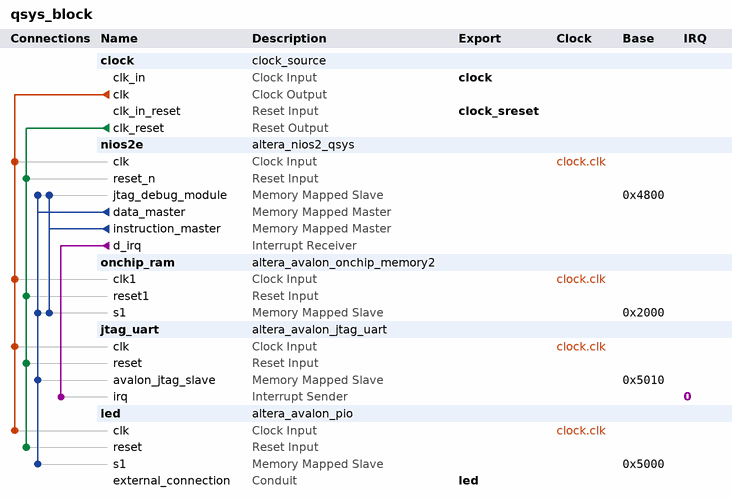
[diagram p0: system contents]
# Platform Designer (Qsys) system qsys_block, Cyclone IV E EP4CE22F17C6
# Parameters at their usual value, and those the tool derives, are not listed.
package require -exact qsys 13.1
create_system qsys_block
set_project_property DEVICE_FAMILY {Cyclone IV E}
set_project_property DEVICE EP4CE22F17C6

add_instance clock clock_source 13.1
set_instance_parameter_value clock clockFrequency 50000000
set_instance_parameter_value clock resetSynchronousEdges BOTH

add_instance nios2e altera_nios2_qsys 13.1
set_instance_parameter_value nios2e resetSlave onchip_ram.s1
set_instance_parameter_value nios2e mmu_TLBMissExcSlave None
set_instance_parameter_value nios2e exceptionSlave onchip_ram.s1
set_instance_parameter_value nios2e breakSlave nios2e.jtag_debug_module
set_instance_parameter_value nios2e impl Tiny
set_instance_parameter_value nios2e icache_size 4096

add_instance onchip_ram altera_avalon_onchip_memory2 13.1
set_instance_parameter_value onchip_ram dataWidth 32
set_instance_parameter_value onchip_ram dualPort false
set_instance_parameter_value onchip_ram initMemContent true
set_instance_parameter_value onchip_ram initializationFileName onchip_mem.hex
set_instance_parameter_value onchip_ram memorySize 8192

add_instance jtag_uart altera_avalon_jtag_uart 13.1
set_instance_parameter_value jtag_uart simInteractiveOptions NO_INTERACTIVE_WINDOWS

add_instance led altera_avalon_pio 13.1
set_instance_parameter_value led direction Output
set_instance_parameter_value led width 8

# connections
add_connection clock.clk jtag_uart.clk clock
add_connection clock.clk led.clk clock
add_connection clock.clk nios2e.clk clock
add_connection clock.clk onchip_ram.clk1 clock
add_connection clock.clk_reset jtag_uart.reset reset
add_connection clock.clk_reset led.reset reset
add_connection clock.clk_reset nios2e.reset_n reset
add_connection clock.clk_reset onchip_ram.reset1 reset
add_connection nios2e.data_master jtag_uart.avalon_jtag_slave avalon
set_connection_parameter_value nios2e.data_master/jtag_uart.avalon_jtag_slave baseAddress 0x5010
add_connection nios2e.data_master led.s1 avalon
set_connection_parameter_value nios2e.data_master/led.s1 baseAddress 0x5000
add_connection nios2e.data_master nios2e.jtag_debug_module avalon
set_connection_parameter_value nios2e.data_master/nios2e.jtag_debug_module baseAddress 0x4800
add_connection nios2e.data_master onchip_ram.s1 avalon
set_connection_parameter_value nios2e.data_master/onchip_ram.s1 baseAddress 0x2000
add_connection nios2e.instruction_master nios2e.jtag_debug_module avalon
set_connection_parameter_value nios2e.instruction_master/nios2e.jtag_debug_module baseAddress 0x4800
add_connection nios2e.instruction_master onchip_ram.s1 avalon
set_connection_parameter_value nios2e.instruction_master/onchip_ram.s1 baseAddress 0x2000
add_connection nios2e.d_irq jtag_uart.irq interrupt
set_connection_parameter_value nios2e.d_irq/jtag_uart.irq irqNumber 0

# exported interfaces
add_interface clock clock sink
set_interface_property clock EXPORT_OF clock.clk_in
add_interface clock_sreset reset sink
set_interface_property clock_sreset EXPORT_OF clock.clk_in_reset
add_interface led conduit end
set_interface_property led EXPORT_OF led.external_connection

set_interconnect_requirement {$system} qsys_mm.clockCrossingAdapter HANDSHAKE
set_interconnect_requirement {$system} qsys_mm.maxAdditionalLatency 1

save_system qsys_block.qsys
